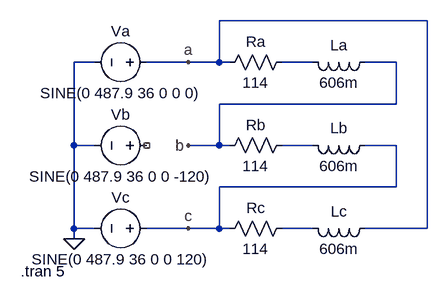
[diagram p0: schematic Star-delta5.asc]
Star-delta5.asc, the LTspice schematic file:
Version 4
SHEET 1 880 680
WIRE 624 -128 304 -128
WIRE 112 -64 80 -64
WIRE 256 -64 192 -64
WIRE 304 -64 304 -128
WIRE 304 -64 256 -64
WIRE 320 -64 304 -64
WIRE 448 -64 400 -64
WIRE 576 -64 528 -64
WIRE 576 0 576 -64
WIRE 576 0 304 0
WIRE 80 64 80 -64
WIRE 112 64 80 64
WIRE 304 64 304 0
WIRE 304 64 256 64
WIRE 320 64 304 64
WIRE 448 64 400 64
WIRE 576 64 528 64
WIRE 576 128 576 64
WIRE 576 128 304 128
WIRE 80 192 80 64
WIRE 112 192 80 192
WIRE 256 192 192 192
WIRE 304 192 304 128
WIRE 304 192 256 192
WIRE 320 192 304 192
WIRE 448 192 400 192
WIRE 624 192 624 -128
WIRE 624 192 528 192
WIRE 80 208 80 192
FLAG 256 -64 a
FLAG 256 64 b
FLAG 256 192 c
FLAG 80 208 0
SYMBOL voltage 208 -64 R90
WINDOW 0 -32 56 VBottom 2
WINDOW 3 32 56 VTop 2
WINDOW 123 0 0 Left 0
WINDOW 39 0 0 Left 0
SYMATTR InstName Va
SYMATTR Value SINE(0 487.9 36 0 0 0)
SYMBOL voltage 208 64 R90
WINDOW 0 -32 56 VBottom 2
WINDOW 3 32 56 VTop 2
WINDOW 123 0 0 Left 0
WINDOW 39 0 0 Left 0
SYMATTR InstName Vb
SYMATTR Value SINE(0 487.9 36 0 0 -120)
SYMBOL voltage 208 192 R90
WINDOW 0 -32 56 VBottom 2
WINDOW 3 32 56 VTop 2
WINDOW 123 0 0 Left 0
WINDOW 39 0 0 Left 0
SYMATTR InstName Vc
SYMATTR Value SINE(0 487.9 36 0 0 120)
SYMBOL res 416 -80 R90
WINDOW 0 0 56 VBottom 2
WINDOW 3 32 56 VTop 2
SYMATTR InstName Ra
SYMATTR Value 114
SYMBOL res 416 48 R90
WINDOW 0 0 56 VBottom 2
WINDOW 3 32 56 VTop 2
SYMATTR InstName Rb
SYMATTR Value 114
SYMBOL res 416 176 R90
WINDOW 0 0 56 VBottom 2
WINDOW 3 32 56 VTop 2
SYMATTR InstName Rc
SYMATTR Value 114
SYMBOL ind 544 -80 R90
WINDOW 0 5 56 VBottom 2
WINDOW 3 32 56 VTop 2
SYMATTR InstName La
SYMATTR Value 606m
SYMBOL ind 544 48 R90
WINDOW 0 5 56 VBottom 2
WINDOW 3 32 56 VTop 2
SYMATTR InstName Lb
SYMATTR Value 606m
SYMBOL ind 544 176 R90
WINDOW 0 5 56 VBottom 2
WINDOW 3 32 56 VTop 2
SYMATTR InstName Lc
SYMATTR Value 606m
TEXT -2 258 Left 2 !.tran 5

The netlist it stands for:
* Star-delta5.asc
Va a 0 SINE(0 487.9 36 0 0 0)
Vb NC_01 0 SINE(0 487.9 36 0 0 -120)
Vc c 0 SINE(0 487.9 36 0 0 120)
Ra N001 a 114
Rb N002 b 114
Rc N003 c 114
La b N001 606m
Lb c N002 606m
Lc a N003 606m
.tran 5
.backanno
.end

* Results of the author's LTspice run, read from the files saved beside the schematic
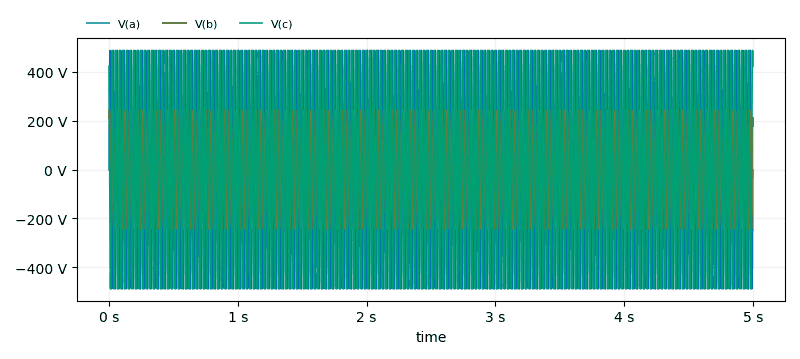
[diagram p1: Transient Analysis of Star-delta5.asc, plotted from the saved traces]
* Transient Analysis, 1 run:
*   V(a): min -487.6 V, max 487.6 V, average 0 V, rms 345 V, last 0 V
*   V(b): min -243.1 V, max 243.1 V, average 668.7 µV, rms 171.3 V, last 211.3 V
*   V(c): min -487.6 V, max 487.6 V, average 287.3 µV, rms 345 V, last 422.5 V